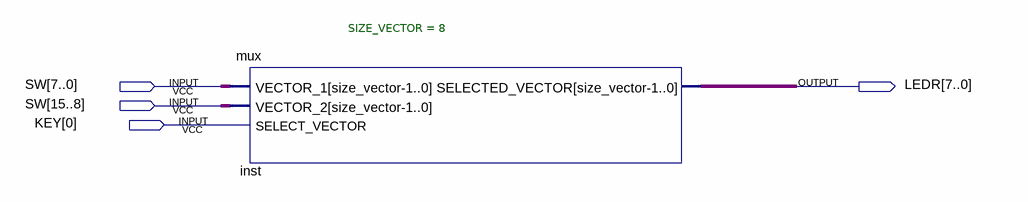
[diagram p0: schematic sheet]
// Quartus schematic mux_test.bdf as structural Verilog: 1 symbols, 4 pins
module mux_test (
  input  [15:0] SW,
  input  [0:0] KEY,
  output [7:0] LEDR
);

  mux #(.SIZE_VECTOR(8)) inst (.VECTOR_1(SW[7:0]), .VECTOR_2(SW[15:8]), .SELECT_VECTOR(KEY[0]), .SELECTED_VECTOR(LEDR));
endmodule
